# Altium schematic sheet MSP430_power_jtag.SchDoc: SVPXFMC Carrier 3U
size A4; CheckedBy: \; Author: G.Kasprowicz; CompanyName: ISE; DrawnBy: T.Przywozki; Organization: WUT ISE; Address1: Warsaw University of Technology; Address2: Nowowiejska 15/19 00-665 Warsaw; Revision: 1.0.; SheetNumber: 17; SheetTotal: 20; Project: SVPXFMC Carrier 3U; ModifiedBy: -; CheckedDate: -; Title2: MSP430 power and JTAG; DivGrp: ISE; Designer: G. Kasprowicz
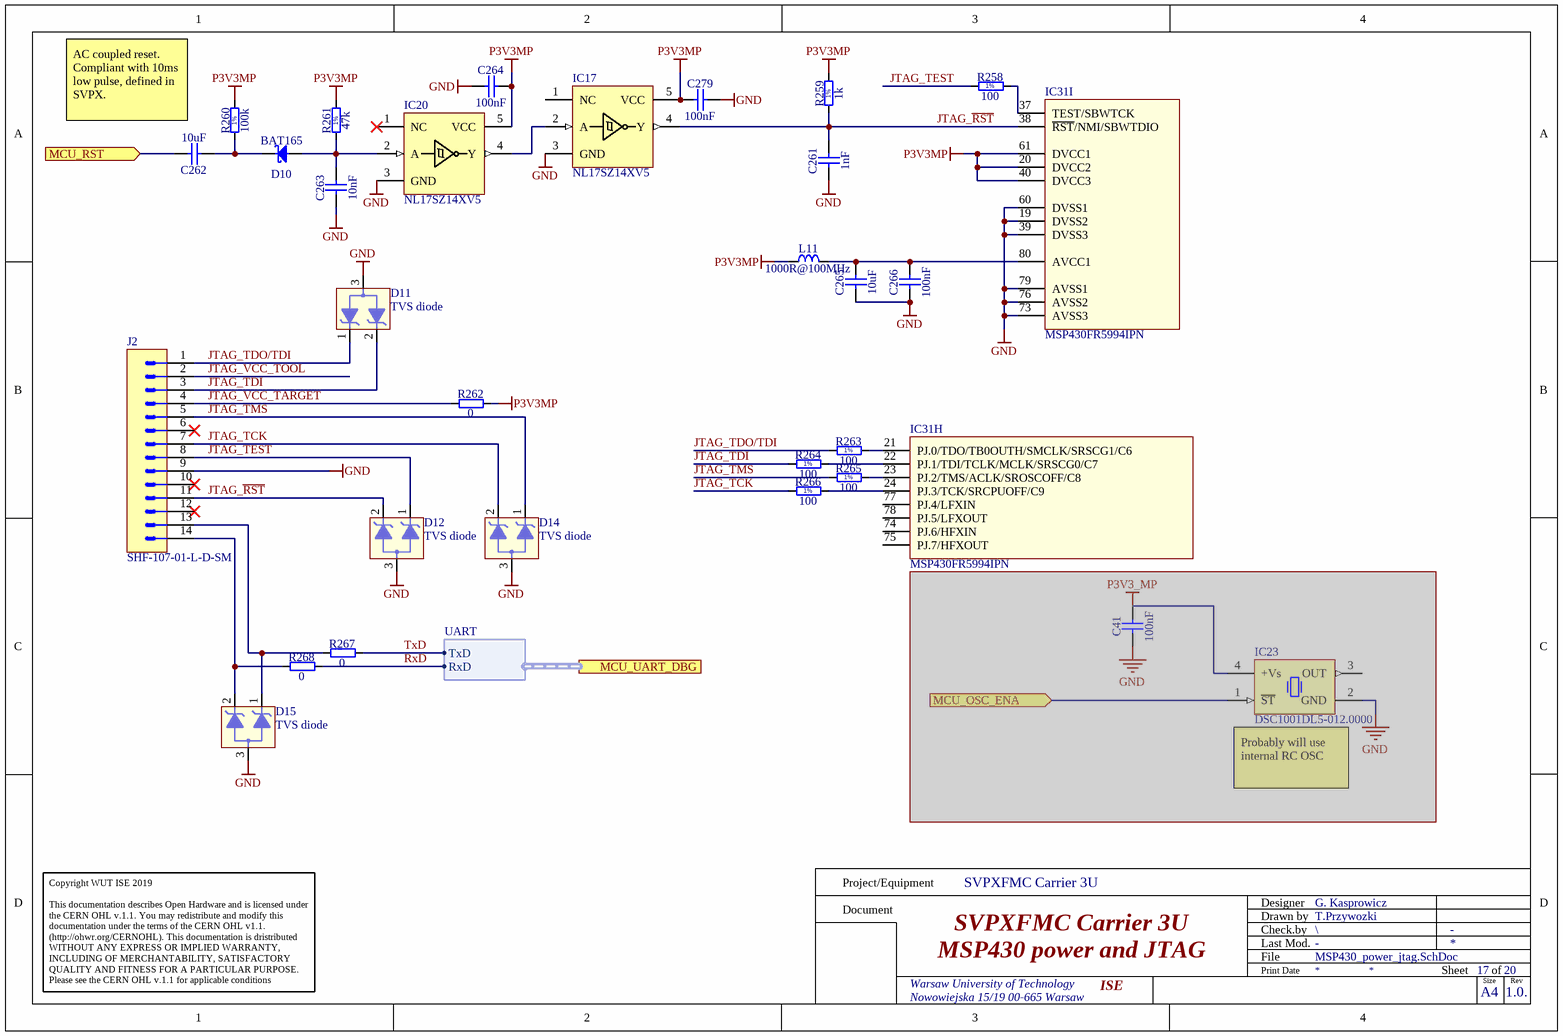
[diagram p0: MSP430_power_jtag.SchDoc]

## Parts
C41  100nF  [CAPC1005X55N]  (masked out: inside a compile mask, not in the netlist)
C261  1nF  [CAPC1005X55N]
C262  10uF  [CAPC1608X80N]
C263  10nF  [CAPC1005X55N]
C264  100nF  [CAPC1005X55N]
C265  10uF  [CAPC1608X80N]
C266  100nF  [CAPC1005X55N]
C279  100nF  [CAPC1005X55N]
D10  BAT165  [SOD2512X110N]
D11  TVS diode  [SOT-723_(ESD7C3.3DT5G)]
D12  TVS diode  [SOT-723_(ESD7C3.3DT5G)]
D14  TVS diode  [SOT-723_(ESD7C3.3DT5G)]
D15  TVS diode  [SOT-723_(ESD7C3.3DT5G)]
IC17  NL17SZ14XV5  [SOT50P160X60-5N]
IC20  NL17SZ14XV5  [SOT50P160X60-5N]
IC23  DSC1001DL5-012.0000  [OSC_MICREL_2520]  (masked out: inside a compile mask, not in the netlist)
IC31  MSP430FR5994IPN  [PQFP50P1400X1400-80N]  (parts H,I of 9)
J2  SHF-107-01-L-D-SM  [SHF-107-01-L-D-SM-LC]
L11  1000R@100MHz  [INDC1608X95N]
R258  100  [RESC1005X40N]
R259  1k  [RESC1005X40N]
R260  100k  [RESC1005X40N]
R261  47k  [RESC1005X40N]
R262  0  [RESC1608X55N]
R263  100  [RESC1005X40N]
R264  100  [RESC1005X40N]
R265  100  [RESC1005X40N]
R266  100  [RESC1005X40N]
R267  0  [RESC1608X55N]
R268  0  [RESC1608X55N]

## Ports
MCU_OSC_ENA (in), MCU_RST (in), MCU_UART_DBG (harness UART)

## Harnesses
UART: TxD, RxD

## Nets
GND: C261.1 C263.1 C264.1 C265.1 C266.1 C279.2 D11.3 D12.3 D14.3 D15.3 IC17.3(GND) IC20.3(GND) IC31.19(DVSS2) IC31.39(DVSS3) IC31.60(DVSS1) IC31.73(AVSS3) IC31.76(AVSS2) IC31.79(AVSS1) J2.9
P3V3MP: C264.2 C279.1 IC17.5(VCC) IC20.5(VCC) IC31.20(DVCC2) IC31.40(DVCC3) IC31.61(DVCC1) L11.1 R259.2 R260.2 R261.2 R262.2
JTAG_~{RST}: C261.2 D12.2 IC17.4(Y) IC31.38(~{RST}/NMI/SBWTDIO) J2.11 R259.1
JTAG_TCK: D14.2 J2.7 R266.1
JTAG_TDI: D11.2 J2.3 R264.1
JTAG_TDO/TDI: D11.1 J2.1 R263.1
JTAG_TEST: D12.1 J2.8 R258.1
JTAG_TMS: D14.1 J2.5 R265.1
JTAG_VCC_TARGET: J2.4 R262.1
JTAG_VCC_TOOL: J2.2
MCU_RST: C262.2 ; port MCU_RST
RxD: R268.2 ; port MCU_UART_DBG.RxD
TxD: R267.2 ; port MCU_UART_DBG.TxD
NetC262_1: C262.1 D10.1(C) R260.1
NetC263_2: C263.2 D10.2(A) IC20.2(A) R261.1
NetC265_2: C265.2 C266.2 IC31.80(AVCC1) L11.2
NetD15_1: D15.1 J2.13 R267.1
NetD15_2: D15.2 J2.14 R268.1
NetIC17_2: IC17.2(A) IC20.4(Y)
NetIC31_21: IC31.21(PJ.0/TDO/TB0OUTH/SMCLK/SRSCG1/C6) R263.2
NetIC31_22: IC31.22(PJ.1/TDI/TCLK/MCLK/SRSCG0/C7) R264.2
NetIC31_23: IC31.23(PJ.2/TMS/ACLK/SROSCOFF/C8) R265.2
NetIC31_24: IC31.24(PJ.3/TCK/SRCPUOFF/C9) R266.2
NetIC31_37: IC31.37(TEST/SBWTCK) R258.2

Not connected (* = marked no-connect by the designer): IC17 1(NC); IC20 1(NC)*; IC31 74(PJ.6/HFXIN) 75(PJ.7/HFXOUT) 77(PJ.4/LFXIN) 78(PJ.5/LFXOUT); J2 6* 10* 12*

## Notes on the sheet
- AC coupled reset. Compliant with 10ms low pulse, defined in SVPX.
- (near J2) Verify JTAG connection. Documentation connects 1 pin of the connector to "TDI/TDO" pin uC.
  IO description does not contain a pin described as "TDI/TDO".
- (near IC23) Probably will use internal RC OSC
- Project/Equipment
- Document
- Designer
- Drawn by
- Check.by
- Copyright WUT ISE 2019
  This documentation describes Open Hardware and is licensed under the CERN OHL v.1.1. You may redistribute and modify this documentation under the terms of the CERN OHL v1.1.
  (http://ohwr.org/CERNOHL). This documentation is dristributed WITHOUT ANY EXPRESS OR IMPLIED WARRANTY, INCLUDING OF MERCHANTABILITY, SATISFACTORY QUALITY AND FITNESS FOR A PARTICULAR PURPOSE. Please see the CERN OHL v.1.1 for applicable conditions
- File
- Last Mod.
- Print Date
- Sheet
- Size
- A4
- of
- Rev
- (in symbol R0402_1K_1%_0.0625W_100PPM) 1%
- (in symbol R0402_47K_1%_0.0625W_100PPM) 1%
- (in symbol R0402_100K_1%_0.0625W_100PPM) 1%
- (in symbol R0402_100R_1%_0.0625W_100PPM) 1%

## Library data of the parts
C41 C264 C266 C279 = CC0402_100NF_25V_10%_X7R_YUDEN_TMK105B7104KVHF: Non-polarised capacitor; Part Description: SMD Multilayer Chip Ceramic Capacitor (High Dielectric Type) for Automotive / Industrial Applications; Manufacturer: TAIYO YUDEN; Voltage: 25V; TC: X7R; Tolerance: ±10%; Part Number: CC0402_100NF_25V_10%_X7R_YUDEN_TMK105B7104KVHF; Component Kind: Standard; Component Type: Standard; Pin Count: 2; Value: 100nF; Status: Not Recommended; Manufacturer Part Number: TMK105B7104KVHF; Case: 0402; Mounted: Yes; Socket: No; SMD: Yes; Sense: No; HelpURL: \\cern.ch\dfs\Applications\Altium\Datasheets\CC0402_TAIYO-YUDEN_TMK105B7104KVHF.pdf; Author: CERN DEM JLC; CreateDate: 10.05.2017; LatestRevisionDate: 10.05.2017; ComponentHeight: 0.55mm
C261 = CC0402_1NF_50V_10%_X7R: Non-polarised capacitor; Part Description: SMD Multilayer Chip Ceramic Capacitor; Manufacturer: GENERIC; Manufacturer1 Part Number: 223858715623; Voltage: 50V; TC: X7R; Tolerance: ±10%; Part Number: CC0402_1NF_50V_10%_X7R; Component Kind: Standard; Component Type: Standard; Pin Count: 2; Value: 1nF; Status: Not Recommended; Manufacturer Part Number: CC0402_1NF_50V_10%_X7R; Case: 0402; Mounted: Yes; Socket: No; SMD: Yes; Sense: No; Manufacturer1 Example: PHYCOMP; Manufacturer1 ComponentHeight: 0.55mm; HelpURL: \\cern.ch\dfs\Applications\Altium\Datasheets\CC0402_X7R_PHYCOMP.pdf; Author: CERN DEM JLC; CreateDate: 03.12.2007; LatestRevisionDate: 03.12.2007
C262 C265 = CC0603_10UF_16V_20%_X5R: Non-polarised capacitor; Part Description: SMD Multilayer Chip Ceramic Capacitor; Manufacturer: GENERIC; Manufacturer1 Part Number: GRM188R61C106MA73D; Voltage: 16V; TC: X5R; Tolerance: ±20%; Part Number: CC0603_10UF_16V_20%_X5R; Component Kind: Standard; Component Type: Standard; Pin Count: 2; Value: 10uF; Status: None; Manufacturer Part Number: CC0603_10UF_16V_20%_X5R; Case: 0603; Mounted: Yes; Socket: No; SMD: Yes; Sense: No; Manufacturer1 Example: MURATA; Manufacturer1 ComponentHeight: 0.8mm; HelpURL: \\cern.ch\dfs\Applications\Altium\Datasheets\CC0603_X5R_MURATA_GRM.pdf; Author: CERN DEM MR; CreateDate: 2016-03-02; LatestRevisionDate: 2016-03-02
C263 = CC0402_10NF_50V_10%_X7R: Non-polarised capacitor; Part Description: SMD Multilayer Chip Ceramic Capacitor; Manufacturer: GENERIC; Manufacturer1 Part Number: GRM155R71H103KA88D; Voltage: 50V; TC: X7R; Tolerance: ±10%; Part Number: CC0402_10NF_50V_10%_X7R; Component Kind: Standard; Component Type: Standard; Pin Count: 2; Value: 10nF; Status: None; Manufacturer Part Number: CC0402_10NF_50V_10%_X7R; Case: 0402; Mounted: Yes; Socket: No; SMD: Yes; Sense: No; Manufacturer1 Example: MURATA; Manufacturer1 ComponentHeight: 0.55mm; HelpURL: \\cern.ch\dfs\Applications\Altium\Datasheets\CC0402_X7R_MURATA_GRM.pdf; Author: CERN DEM MR; CreateDate: 08.01.2016; LatestRevisionDate: 08.01.2016
D10 = BAT165: Schottky Diode; Part Description: Medium Power AF Schottky Diode; Manufacturer: INFINEON; Voltage: 40V; Power: 750mA; PressFit: No; Bonding: No; Part Number: BAT165; Component Kind: Standard; Component Type: Standard; Device: BAT165; PackageDescription: Small Outline Diode (SOD-323), 1.70mm W X 1.25mm L X 1.10mm H body,  IPC Medium Density; Manufacturer Part Number: BAT165; Pin Count: 2; Case: SOD323; Mounted: Yes; Socket: No; SMD: Yes; Sense: No; ComponentHeight: 1.1mm; HelpURL: \\cern.ch\dfs\Applications\Altium\Datasheets\BAT165.pdf; Author: CERN DEM JLC; CreateDate: 12.11.2014; LatestRevisionDate: 12.11.2014
D11 D12 D14 D15 = ESD7C3.3DT5G: Dual TVS diode, Vrwm=3.3V; Manufacturer: ON Semiconductor; Bonding: No; ComponentHeigth: 0.5mm; PressFit: No; Value: 3.3V; Case: SOT-723; Component Kind: Standard; Component Type: Standard; CreateDate: 2018-06-18; Device: TVS diode; HelpURL: https://www.onsemi.com/pub/Collateral/ESD7C3.3D-D.PDF; LatestRevisionDate: 2018-06-18; Manufacturer Part Number: ESD7C3.3DT5G; Mounted: Yes; PackageDescription: SOT-723; Part Description: TVS diode; Part Number: ESD7C3.3DT5G; Pin Count: 3; Sense: No; SMD: Yes; Socket: No
IC17 IC20 = NL17SZ14XV5: Single inverter with schmitt trigger; Manufacturer: On Semiconductor; Bonding: No; ComponentHeigth: 0.55mm; PressFit: No; Case: SOT-553; Component Kind: Standard; Component Type: Standard; CreateDate: 2019-05-06; Device: NL17SZ14XV5; Footprint: SOT23-5; HelpURL: https://www.onsemi.com/pub/Collateral/NL17SZ14-D.PDF; LatestRevisionDate: 2018-01-01; Manufacturer Part Number: NL17SZ14XV5; Mounted: Yes; PackageDescription: Body 1.6x1.2mm, Pitch 0.5mm; Part Description: Single inverter with schmitt trigger; Part Number: NL17SZ14XV5; Pin Count: 5; Sense: No; SMD: Yes; Socket: No; Value: *
IC23 = DSC1001DL5-012.0000: MEMS Oscillator 12MHz; Manufacturer: Micrel; Bonding: No; PressFit: No; Case: *; Component Kind: Standard; Component Type: Standard; ComponentHeigth: *; CreateDate: 2018-05-21; Device: DSC1001DL5-012.0000; Footprint: MICREL SMD Oscillator, QFN, 4 pins, 2.5mm x 2.0mm; HelpURL: *; LatestRevisionDate: 2018-05-21; Manufacturer Part Number: DSC1001DL5-012.0000; Mounted: Yes; PackageDescription: MICREL SMD Oscillator, QFN, 4 pins, 2.5mm x 2.0mm; Part Description: MEMS Oscillator 12MHz; Part Number: DSC1001DL5-012.0000; Pin Count: 4; Sense: No; SMD: Yes; Socket: No; Value: *
IC31 = MSP430FR5994IPN: Manufacturer: TI; Part Description: FRAM microcontroller; Bonding: No; ComponentHeigth: 2mm; PressFit: No; Case: LQFP80; Component Kind: Standard; Component Type: Standard; CreateDate: 2018-01-01; Device: MSP430FR5994IPN; Footprint: LQFP80; HelpURL: *; LatestRevisionDate: 2018-01-01; Manufacturer Part Number: MSP430FR5994IPN; Mounted: Yes; PackageDescription: LQFP80; Part Number: MSP430FR5994IPN; Pin Count: 80; Sense: No; SMD: Yes; Socket: No; Value: *
J2 = SHF-107-01-L-D-SM: Header, 14 contacts, Pitch 1,27mm, Double Row, SMD; Manufacturer: Samtec; Part Description: Horizontal header, 14 contacts, Pitch 2.54mm, Double Row, SMD; Bonding: No; ComponentHeigth: 6.1mm; PressFit: No; Case: SHF-107-01-L-D-SM; Component Kind: Standard; Component Type: Standard; CreateDate: 2018-12-07; Device: SHF-107-01-L-D-SM; Footprint: SHF-107-01-L-D-SM; HelpURL: http://suddendocs.samtec.com/prints/shf-1xx-01-x-d-xx-xx-footprint.pdf; LatestRevisionDate: 2018-12-07; Manufacturer Part Number: SHF-107-01-L-D-SM; Mounted: Yes; Part Number: SHF-107-01-L-D-SM; Pin Count: 14; Sense: No; SMD: No; Socket: No; Value: *
L11 = IND0603_MURATA_BLM18HE102SN1: Inductor; Part Description: SMD EMIFIL Suppression Chip Ferrite Bead; Manufacturer: MURATA; Power: 600mA; Resistance: 0.35R; Tolerance: ±25%; Part Number: IND0603_MURATA_BLM18HE102SN1; Component Kind: Standard; Component Type: Standard; Pin Count: 2; Value: 1000R@100MHz; Status: None; Manufacturer Part Number: BLM18HE102SN1; Case: 0603; Mounted: Yes; Socket: No; SMD: Yes; Sense: No; ComponentHeight: 0.95mm; HelpURL: \\cern.ch\dfs\Applications\Altium\Datasheets\IND0603_MURATA_BLM18H.pdf; Author: CERN DEM JLC; CreateDate: 09/12/2013; LatestRevisionDate: 09/12/2013
R258 R263-R266 = R0402_100R_1%_0.0625W_100PPM: Resistor - 1%; Part Description: General Purpose Thick Film Chip Resistor; Manufacturer: GENERIC; Manufacturer1 Part Number: 232270671001L; TC: ±100ppm/°C; PressFit: No; Part Number: R0402_100R_1%_0.0625W_100PPM; Component Kind: Standard; Component Type: Standard; Pin Count: 2; Value: 100; Status: Not Recommended; Power: 0.0625W; Tolerance: ±1%; Manufacturer Part Number: R0402_100R_1%_0.0625W_100PPM; Case: 0402; Mounted: Yes; Sense: No; Socket: No; SMD: Yes; Manufacturer1 Example: YAGEO PHYCOMP; Manufacturer1 ComponentHeight: 0.4mm; HelpURL: \\cern.ch\dfs\Applications\Altium\Datasheets\R0402_Phycomp_RC0402.pdf; Author: CERN DEM JLC; CreateDate: 03.12.2007; LatestRevisionDate: 17.10.2012
R259 = R0402_1K_1%_0.0625W_100PPM: Resistor - 1%; Part Description: General Purpose Thick Film Chip Resistor; Manufacturer: GENERIC; Manufacturer1 Part Number: 232270671002L; TC: ±100ppm/°C; PressFit: No; Part Number: R0402_1K_1%_0.0625W_100PPM; Component Kind: Standard; Component Type: Standard; Pin Count: 2; Value: 1k; Status: Not Recommended; Power: 0.0625W; Tolerance: ±1%; Manufacturer Part Number: R0402_1K_1%_0.0625W_100PPM; Case: 0402; Mounted: Yes; Sense: No; Socket: No; SMD: Yes; Manufacturer1 Example: YAGEO PHYCOMP; Manufacturer1 ComponentHeight: 0.4mm; HelpURL: \\cern.ch\dfs\Applications\Altium\Datasheets\R0402_Phycomp_RC0402.pdf; Author: CERN DEM JLC; CreateDate: 03.12.2007; LatestRevisionDate: 17.10.2012
R260 = R0402_100K_1%_0.0625W_100PPM: Resistor - 1%; Part Description: General Purpose Thick Film Chip Resistor; Manufacturer: GENERIC; Manufacturer1 Part Number: 232270671004L; TC: ±100ppm/°C; PressFit: No; Part Number: R0402_100K_1%_0.0625W_100PPM; Component Kind: Standard; Component Type: Standard; Pin Count: 2; Value: 100k; Status: Not Recommended; Power: 0.0625W; Tolerance: ±1%; Manufacturer Part Number: R0402_100K_1%_0.0625W_100PPM; Case: 0402; Mounted: Yes; Sense: No; Socket: No; SMD: Yes; Manufacturer1 Example: YAGEO PHYCOMP; Manufacturer1 ComponentHeight: 0.4mm; HelpURL: \\cern.ch\dfs\Applications\Altium\Datasheets\R0402_Phycomp_RC0402.pdf; Author: CERN DEM JLC; CreateDate: 03.12.2007; LatestRevisionDate: 17.10.2012
R261 = R0402_47K_1%_0.0625W_100PPM: Resistor - 1%; Part Description: General Purpose Thick Film Chip Resistor; Manufacturer: GENERIC; Manufacturer1 Part Number: 232270675103L; TC: ±100ppm/°C; PressFit: No; Part Number: R0402_47K_1%_0.0625W_100PPM; Component Kind: Standard; Component Type: Standard; Pin Count: 2; Value: 47k; Status: Not Recommended; Power: 0.0625W; Tolerance: ±1%; Manufacturer Part Number: R0402_47K_1%_0.0625W_100PPM; Case: 0402; Mounted: Yes; Sense: No; Socket: No; SMD: Yes; Manufacturer1 Example: YAGEO PHYCOMP; Manufacturer1 ComponentHeight: 0.4mm; HelpURL: \\cern.ch\dfs\Applications\Altium\Datasheets\R0402_Phycomp_RC0402.pdf; Author: CERN DEM JLC; CreateDate: 03.12.2007; LatestRevisionDate: 17.10.2012
R262 R267 R268 = R0603_0R_JUMPER: Resistor; Part Description: 1A (0.05R Max DC Resistance) Zero Ohm Jumper; Manufacturer: GENERIC; Manufacturer1 Part Number: NRC06Z0; PressFit: No; Part Number: R0603_0R_JUMPER; Component Kind: Standard; Component Type: Standard; Pin Count: 2; Value: 0; Status: Preferred; Manufacturer Part Number: R0603_0R_JUMPER; Case: 0603; Mounted: Yes; Sense: No; Socket: No; SMD: Yes; Manufacturer1 Example: NIC COMPONENT; Manufacturer1 ComponentHeight: 0.55mm; HelpURL: \\cern.ch\dfs\Applications\Altium\Datasheets\R0603_NIC_NRC.pdf; Author: CERN DEM JLC; CreateDate: 03.12.2007; LatestRevisionDate: 13.03.2008